# Altium schematic sheet MCU.SchDoc
size A4
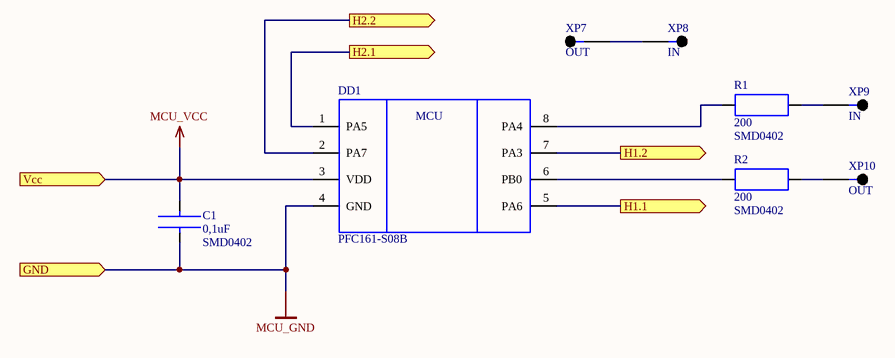
[diagram p0: MCU.SchDoc]

## Parts
C1  0,1uF  Package: SMD0402  [SMD0402(1608)]
DD1  PFC161-S08B  [SOIC8]
R1  200  Package: SMD0402  [SMD0402(1608)]
R2  200  Package: SMD0402  [SMD0402(1608)]
XP7  OUT  [XP_solder]
XP8  IN  [XP_solder]
XP9  IN  [XP_solder]
XP10  OUT  [XP_solder]

## Ports
GND (in), H1.1 (out), H1.2 (out), H2.1 (out), H2.2 (out), Vcc (in)

## Nets
MCU_GND: C1.2 DD1.4(GND) ; port GND
MCU_VCC: C1.1 DD1.3(VDD) ; port Vcc
H1.1: DD1.5(PA6) ; port H1.1
H1.2: DD1.7(PA3) ; port H1.2
H2.1: DD1.1(PA5) ; port H2.1
H2.2: DD1.2(PA7) ; port H2.2
NetDD1_6: DD1.6(PB0) R2.1
NetDD1_8: DD1.8(PA4) R1.1
NetR1_2: R1.2 XP9.1
NetR2_2: R2.2 XP10.1
NetXP7_1: XP7.1 XP8.1

## Notes on the sheet
- (in symbol PFC161-S08B) MCU

## Library data of the parts
C1 = CER_CUP_0402: Type: C; ValueBOM: Конденсатор керамический 0,1мкФ х 50В SMD 0402 1%; Value: 0,1uF
DD1 = PFC161-S08B: ValueBOM: Микроконтроллер PFC161-S08B, SOIC-8; Type: DD; Value: PFC161-S08B; Package: SOIC-8
R1 R2 = R_0402: ValueBOM: Резистор 200Ом SMD 0402 1%; Type: R; Value: 200
XP7-XP10 = XP_solder